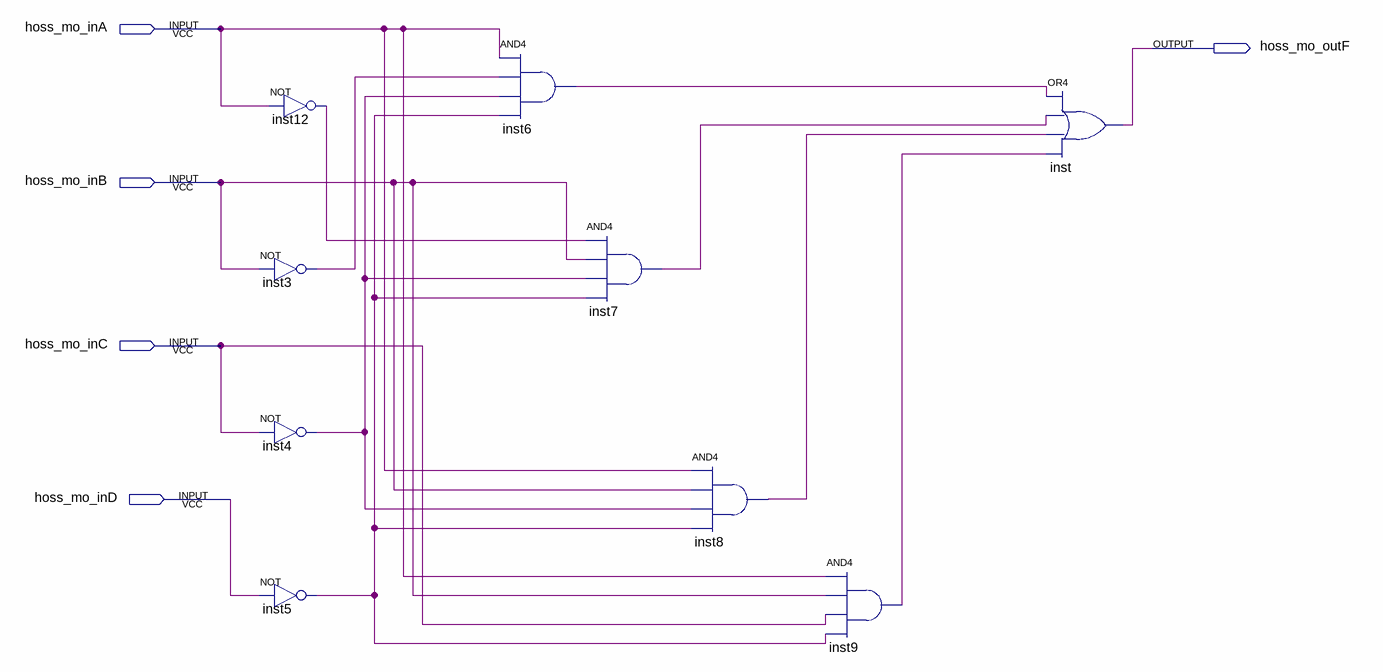
[diagram p0: schematic sheet]
// Quartus schematic segmentF.bdf as structural Verilog: 9 symbols, 5 pins
module segmentF (
  input  hoss_mo_inA,
  input  hoss_mo_inB,
  input  hoss_mo_inC,
  input  hoss_mo_inD,
  output hoss_mo_outF
);

  wire inst3_out, inst4_out, inst5_out, inst6_out, inst7_out, inst8_out, inst9_out, inst12_out;

  not inst12 (inst12_out, hoss_mo_inA);
  not inst3 (inst3_out, hoss_mo_inB);
  not inst4 (inst4_out, hoss_mo_inC);
  not inst5 (inst5_out, hoss_mo_inD);
  and inst6 (inst6_out, hoss_mo_inA, inst3_out, inst4_out, inst5_out);
  and inst7 (inst7_out, inst12_out, hoss_mo_inB, inst4_out, inst5_out);
  and inst8 (inst8_out, hoss_mo_inA, hoss_mo_inB, inst4_out, inst5_out);
  and inst9 (inst9_out, hoss_mo_inA, hoss_mo_inB, hoss_mo_inC, inst5_out);
  or inst (hoss_mo_outF, inst6_out, inst7_out, inst8_out, inst9_out);
endmodule
